# Altium project Base18.PrjPCB
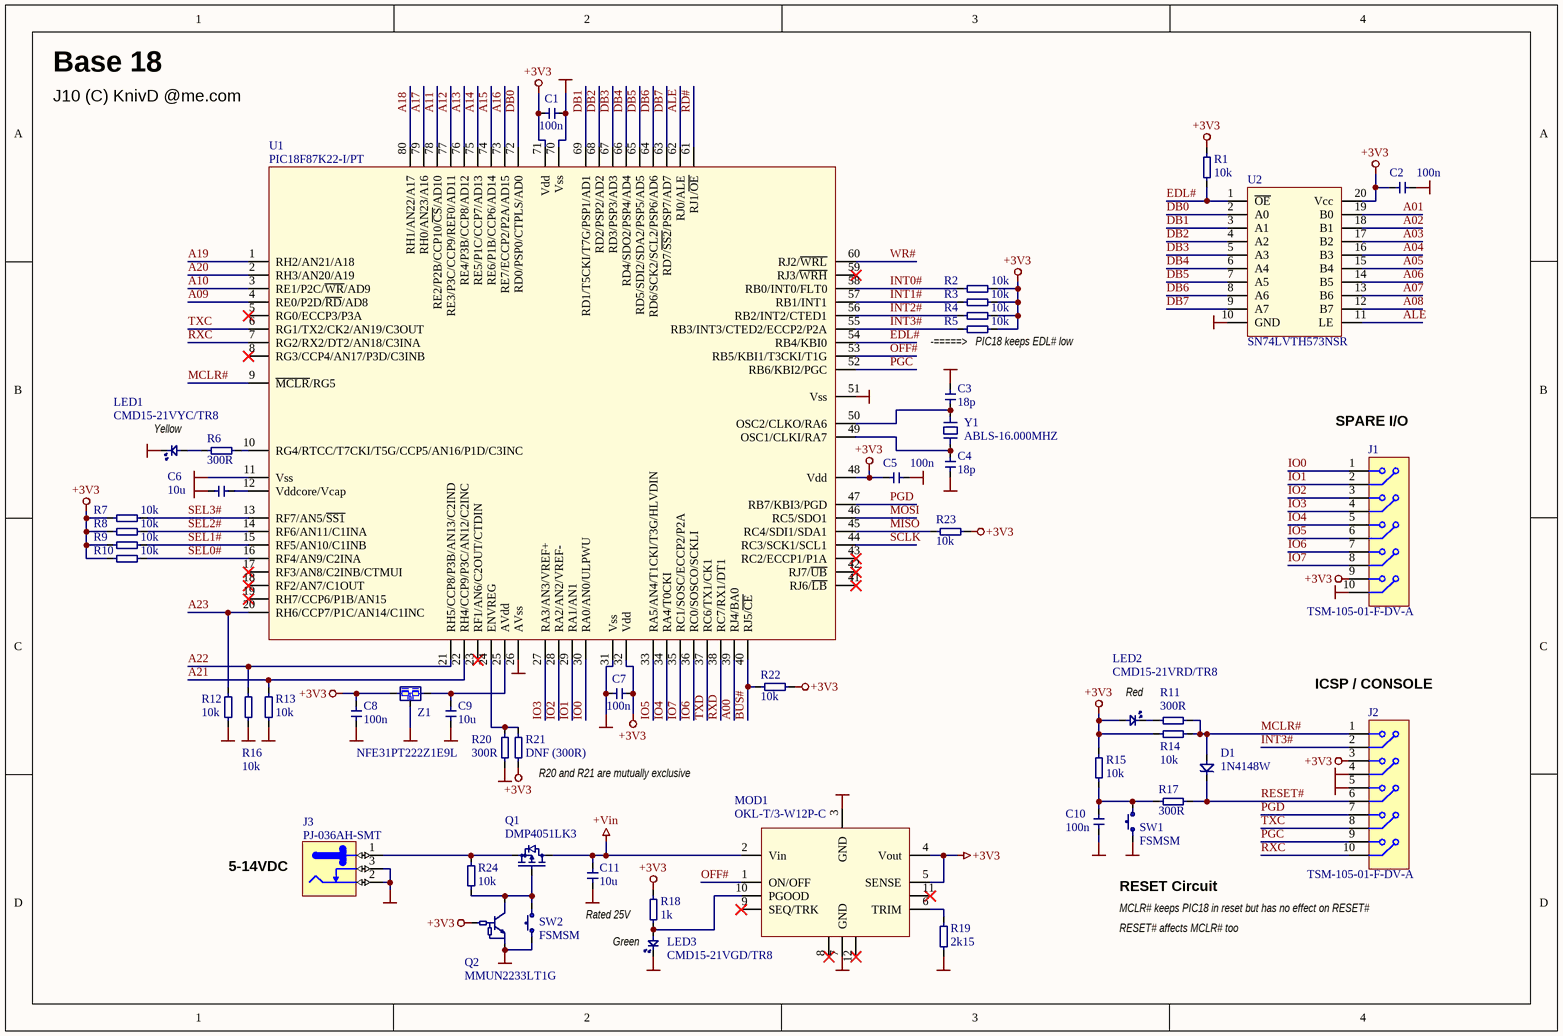
[diagram p0: Sheet1.SchDoc]
2 sheets, 59 parts. Net scope: global (net labels, ports and power ports of the same name join across sheets).
Board file: PCB1.PcbDoc
Sheets:
  Sheet1.SchDoc
  Sheet2.SchDoc

## Sheet Sheet1.SchDoc
size A4

### Parts
C1  100n  [CAPC3216X110N]
C2  100n  [CAPC3216X110N]
C3  18p  [CAPC3216X110N]
C4  18p  [CAPC3216X110N]
C5  100n  [CAPC3216X110N]
C6  10u  [CAPC3216X110N]
C7  100n  [CAPC3216X110N]
C8  100n  [CAPC3216X110N]
C9  10u  [CAPC3216X110N]
C10  100n  [CAPC3216X110N]
C11  Note: 10u  [CAPC3216X110N]  (hidden comment: 10u/25V)
D1  1N4148W  [SOD-123]
J1  TSM-105-01-F-DV-A  [2015-2X05XD]
J2  TSM-105-01-F-DV-A  [2015-2X05XD]
J3  PJ-036AH-SMT  [PJ-036AH-SMT]
LED1  CMD15-21VYC/TR8  [LED_OSRAM_LYN971]
LED2  CMD15-21VRD/TR8  [LED_OSRAM_LHN974]
LED3  CMD15-21VGD/TR8  [LED_OSRAM_LGN971]
MOD1  OKL-T/3-W12P-C  [OKL-T/3-W12]
Q1  DMP4051LK3  [TO228P991X239-3N-R546X521]
Q2  MMUN2233LT1G  [SOT23-3]
R1  10k  [RESC3216X75N]
R2  10k  [RESC3216X75N]
R3  10k  [RESC3216X75N]
R4  10k  [RESC3216X75N]
R5  10k  [RESC3216X75N]
R6  300R  [RESC3216X75N]
R7  10k  [RESC3216X75N]
R8  10k  [RESC3216X75N]
R9  10k  [RESC3216X75N]
R10  10k  [RESC3216X75N]
R11  300R  [RESC3216X75N]
R12  10k  [RESC3216X75N]
R13  10k  [RESC3216X75N]
R14  10k  [RESC3216X75N]
R15  10k  [RESC3216X75N]
R16  10k  [RESC3216X75N]
R17  300R  [RESC3216X75N]
R18  1k  [RESC3216X75N]
R19  2k15  [RESC3216X75N]
R20  300R  [RESC3216X75N]
R21  DNF (300R)  [RESC3216X75N]
R22  10k  [RESC3216X75N]
R23  10k  [RESC3216X75N]
R24  10k  [RESC3216X75N]
SW1  FSMSM  [PB_TYCO_FSMSM]
SW2  FSMSM  [PB_TYCO_FSMSM]
U1  PIC18F87K22-I/PT  [QFP50P1400X1400X120-80N]
U2  SN74LVTH573NSR  [SOIC127P780X200-20N]
Y1  ABLS-16.000MHZ  [XTAL1140X470X160N]
Z1  NFE31PT222Z1E9L  [NFE31xx]

### Nets
+3V3: C1.1 C2.1 C5.1 C7.1 C8.1 J1.9 J2.3 LED2.2 MOD1.4(Vout) MOD1.5(SENSE) Q2.1(B) R1.2 R2.1 R3.1 R4.1 R5.1 R7.1 R8.1 R9.1 R10.1 R14.2 R15.2 R18.1 R21.2 R22.1 R23.1 U1.32(Vdd) U1.48(Vdd) U1.71(Vdd) U2.20(Vcc) Z1.1
+Vin: C11.1 MOD1.2(Vin) Q1.3(D)
GND: C1.2 C2.2 C3.2 C4.1 C5.2 C6.2 C7.2 C8.2 C9.2 C10.1 C11.2 J1.10 J2.4 J2.5 J3.2 J3.3 LED1.1 LED3.1 MOD1.3(GND) MOD1.7(GND) Q2.2(E) R12.2 R13.2 R16.2 R19.1 R20.2 SW1.1 SW2.1 U1.11(Vss) U1.26(AVss) U1.31(Vss) U1.51(Vss) U1.70(Vss) U2.10(GND) Z1.2
A00: U1.39(RJ4/BA0)
A01: U2.19(B0)
A02: U2.18(B1)
A03: U2.17(B2)
A04: U2.16(B3)
A05: U2.15(B4)
A06: U2.14(B5)
A07: U2.13(B6)
A08: U2.12(B7)
A09: U1.4(RE0/P2D/~{RD}/AD8)
A10: U1.3(RE1/P2C/~{WR}/AD9)
A11: U1.78(RE2/P2B/CCP10/~{CS}/AD10)
A12: U1.77(RE3/P3C/CCP9/REF0/AD11)
A13: U1.76(RE4/P3B/CCP8/AD12)
A14: U1.75(RE5/P1C/CCP7/AD13)
A15: U1.74(RE6/P1B/CCP6/AD14)
A16: U1.73(RE7/ECCP2/P2A/AD15)
A17: U1.79(RH0/AN23/A16)
A18: U1.80(RH1/AN22/A17)
A19: U1.1(RH2/AN21/A18)
A20: U1.2(RH3/AN20/A19)
A21: R13.1 U1.22(RH4/CCP9/P3C/AN12/C2INC)
A22: R16.1 U1.21(RH5/CCP8/P3B/AN13/C2IND)
A23: R12.1 U1.20(RH6/CCP7/P1C/AN14/C1INC)
ALE: U1.62(RJ0/ALE) U2.11(LE)
BUS#: R22.2 U1.40(RJ5/~{CE})
DB0: U1.72(RD0/PSP0/CTPLS/AD0) U2.2(A0)
DB1: U1.69(RD1/T5CKI/T7G/PSP1/AD1) U2.3(A1)
DB2: U1.68(RD2/PSP2/AD2) U2.4(A2)
DB3: U1.67(RD3/PSP3/AD3) U2.5(A3)
DB4: U1.66(RD4/SDO2/PSP4/AD4) U2.6(A4)
DB5: U1.65(RD5/SDI2/SDA2/PSP5/AD5) U2.7(A5)
DB6: U1.64(RD6/SCK2/SCL2/PSP6/AD6) U2.8(A6)
DB7: U1.63(RD7/~{SS2}/PSP7/AD7) U2.9(A7)
EDL#: R1.1 U1.54(RB4/KBI0) U2.1(~{OE})
INT0#: R2.2 U1.58(RB0/INT0/FLT0)
INT1#: R3.2 U1.57(RB1/INT1)
INT2#: R4.2 U1.56(RB2/INT2/CTED1)
INT3#: J2.2 R5.2 U1.55(RB3/INT3/CTED2/ECCP2/P2A)
IO0: J1.1 U1.30(RA0/AN0/ULPWU)
IO1: J1.2 U1.29(RA1/AN1)
IO2: J1.3 U1.28(RA2/AN2/VREF-)
IO3: J1.4 U1.27(RA3/AN3/VREF+)
IO4: J1.5 U1.34(RA4/T0CKI)
IO5: J1.6 U1.33(RA5/AN4/T1CKI/T3G/HLVDIN)
IO6: J1.7 U1.36(RC0/SOSCO/SCKLI)
IO7: J1.8 U1.35(RC1/SOSC/ECCP2/P2A)
MCLR#: D1.2 J2.1 R11.1 R14.1 U1.9(~{MCLR}/RG5)
MISO: R23.2 U1.45(RC4/SDI1/SDA1)
MOSI: U1.46(RC5/SDO1)
OFF#: MOD1.1(ON/OFF) U1.53(RB5/KBI1/T3CKI/T1G)
PGC: J2.9 U1.52(RB6/KBI2/PGC)
PGD: J2.7 U1.47(RB7/KBI3/PGD)
RD#: U1.61(RJ1/~{OE})
RESET#: D1.1 J2.6 R17.2
RXC: J2.10 U1.7(RG2/RX2/DT2/AN18/C3INA)
RXD: U1.38(RC7/RX1/DT1)
SCLK: U1.44(RC3/SCK1/SCL1)
SEL0#: R10.2 U1.16(RF4/AN9/C2INA)
SEL1#: R9.2 U1.15(RF5/AN10/C1INB)
SEL2#: R8.2 U1.14(RF6/AN11/C1INA)
SEL3#: R7.2 U1.13(RF7/AN5/~{SS1})
TXC: J2.8 U1.6(RG1/TX2/CK2/AN19/C3OUT)
TXD: U1.37(RC6/TX1/CK1)
WR#: U1.60(RJ2/~{WRL})
NetC3_1: C3.1 U1.50(OSC2/CLKO/RA6) Y1.2
NetC4_2: C4.2 U1.49(OSC1/CLKI/RA7) Y1.1
NetC6_1: C6.1 U1.12(Vddcore/Vcap)
NetC9_1: C9.1 U1.25(AVdd) Z1.3
NetC10_2: C10.2 R15.1 R17.1 SW1.2
NetJ3_1: J3.1 Q1.2(S) R24.2
NetLED1_2: LED1.2 R6.1
NetLED2_1: LED2.1 R11.2
NetLED3_2: LED3.2 MOD1.10(PGOOD) R18.2
NetMOD1_6: MOD1.6(TRIM) R19.2
NetQ1_1: Q1.1(G) Q2.3(C) R24.1 SW2.2
NetR6_2: R6.2 U1.10(RG4/RTCC/T7CKI/T5G/CCP5/AN16/P1D/C3INC)
NetR20_1: R20.1 R21.1 U1.24(ENVREG)

Not connected (* = marked no-connect by the designer): MOD1 8* 9(SEQ/TRK)* 11* 12*; U1 5(RG0/ECCP3/P3A)* 8(RG3/CCP4/AN17/P3D/C3INB)* 17(RF3/AN8/C2INB/CTMUI)* 18(RF2/AN7/C1OUT)* 19(RH7/CCP6/P1B/AN15)* 23(RF1/AN6/C2OUT/CTDIN)* 41(RJ6/~{LB})* 42(RJ7/~{UB})* 43(RC2/ECCP1/P1A)* 59(RJ3/~{WRH})*

### Notes on the sheet
- Base 18
- J10 (C) KnivD @me.com
- (near R5) -=====>   PIC18 keeps EDL# low
- Yellow
- (near J1) SPARE I/O
- Red
- (near J2) ICSP / CONSOLE
- R20 and R21 are mutually exclusive
- 5-14VDC
- Rated 25V
- RESET Circuit
- MCLR# keeps PIC18 in reset but has no effect on RESET#
- Green
- RESET# affects MCLR# too

### Library data of the parts
C1-C11 = Capacitor
D1 = Diode Schottky: Schottky diode
J1 J2 = Connector 2x5: Dual row, 10-way connector
J3 = LUMBERG_161314: 2.1/5.5mm barrel power jack, SMT; Component Kind: Standard; Component Type: Standard; ComponentHeight: 11mm; Author: CERN DEM JLC
LED1-LED3 = LED: Light Emitting Diode
MOD1 = OKL-T/3-W12: Programmable Output 3-Amp iLGA SMT PoLs; Manufacturer: Murata
Q1 = P-FET: P-channel FET transistor
Q2 = NPN BIASED: NPN biased bipolar transistor
R1-R24 = Resistor
SW1 SW2 = Switch MNO SPST: Switch, Momentary, Normal Open
U1 = PIC18F87K22: High-Performance, 1-Mbit Enhanced Flash MCUs  with 12-Bit A/D and XLP Technology; Manufacturer: Microchip; Packages: I/PT (TQFP80-12x12mm); I/MR (QFN80-9x9mm)
U2 = 74xxx373: A Octal Transparent D-Type Latches With 3-State Outputs
Y1 = Crystal: Crystal Resonator
Z1 = Filter: Hybrid filter

## Sheet Sheet2.SchDoc
size A4
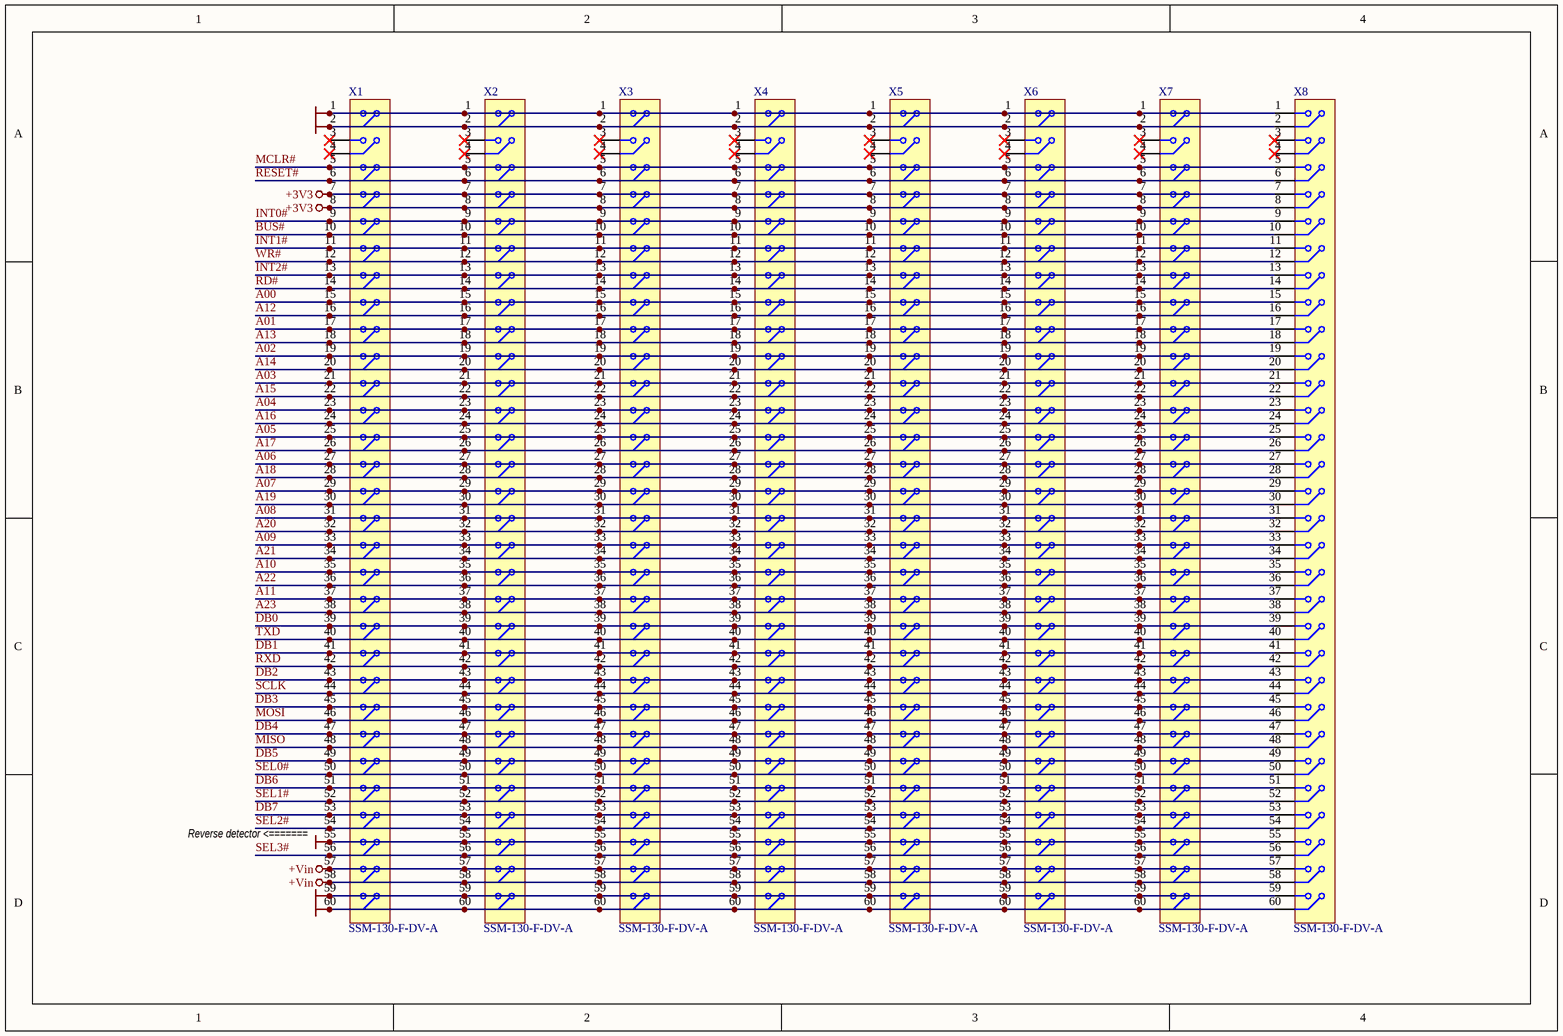
[diagram p1: Sheet2.SchDoc]

### Parts
X1  SSM-130-F-DV-A  [2015-2X30XD]
X2  SSM-130-F-DV-A  [2015-2X30XD]
X3  SSM-130-F-DV-A  [2015-2X30XD]
X4  SSM-130-F-DV-A  [2015-2X30XD]
X5  SSM-130-F-DV-A  [2015-2X30XD]
X6  SSM-130-F-DV-A  [2015-2X30XD]
X7  SSM-130-F-DV-A  [2015-2X30XD]
X8  SSM-130-F-DV-A  [2015-2X30XD]

### Nets
+3V3: X1.7 X1.8 X2.7 X2.8 X3.7 X3.8 X4.7 X4.8 X5.7 X5.8 X6.7 X6.8 X7.7 X7.8 X8.7 X8.8
+Vin: X1.57 X1.58 X2.57 X2.58 X3.57 X3.58 X4.57 X4.58 X5.57 X5.58 X6.57 X6.58 X7.57 X7.58 X8.57 X8.58
GND: X1.1 X1.2 X1.55 X1.59 X1.60 X2.1 X2.2 X2.55 X2.59 X2.60 X3.1 X3.2 X3.55 X3.59 X3.60 X4.1 X4.2 X4.55 X4.59 X4.60 X5.1 X5.2 X5.55 X5.59 X5.60 X6.1 X6.2 X6.55 X6.59 X6.60 X7.1 X7.2 X7.55 X7.59 X7.60 X8.1 X8.2 X8.55 X8.59 X8.60
A00: X1.15 X2.15 X3.15 X4.15 X5.15 X6.15 X7.15 X8.15
A01: X1.17 X2.17 X3.17 X4.17 X5.17 X6.17 X7.17 X8.17
A02: X1.19 X2.19 X3.19 X4.19 X5.19 X6.19 X7.19 X8.19
A03: X1.21 X2.21 X3.21 X4.21 X5.21 X6.21 X7.21 X8.21
A04: X1.23 X2.23 X3.23 X4.23 X5.23 X6.23 X7.23 X8.23
A05: X1.25 X2.25 X3.25 X4.25 X5.25 X6.25 X7.25 X8.25
A06: X1.27 X2.27 X3.27 X4.27 X5.27 X6.27 X7.27 X8.27
A07: X1.29 X2.29 X3.29 X4.29 X5.29 X6.29 X7.29 X8.29
A08: X1.31 X2.31 X3.31 X4.31 X5.31 X6.31 X7.31 X8.31
A09: X1.33 X2.33 X3.33 X4.33 X5.33 X6.33 X7.33 X8.33
A10: X1.35 X2.35 X3.35 X4.35 X5.35 X6.35 X7.35 X8.35
A11: X1.37 X2.37 X3.37 X4.37 X5.37 X6.37 X7.37 X8.37
A12: X1.16 X2.16 X3.16 X4.16 X5.16 X6.16 X7.16 X8.16
A13: X1.18 X2.18 X3.18 X4.18 X5.18 X6.18 X7.18 X8.18
A14: X1.20 X2.20 X3.20 X4.20 X5.20 X6.20 X7.20 X8.20
A15: X1.22 X2.22 X3.22 X4.22 X5.22 X6.22 X7.22 X8.22
A16: X1.24 X2.24 X3.24 X4.24 X5.24 X6.24 X7.24 X8.24
A17: X1.26 X2.26 X3.26 X4.26 X5.26 X6.26 X7.26 X8.26
A18: X1.28 X2.28 X3.28 X4.28 X5.28 X6.28 X7.28 X8.28
A19: X1.30 X2.30 X3.30 X4.30 X5.30 X6.30 X7.30 X8.30
A20: X1.32 X2.32 X3.32 X4.32 X5.32 X6.32 X7.32 X8.32
A21: X1.34 X2.34 X3.34 X4.34 X5.34 X6.34 X7.34 X8.34
A22: X1.36 X2.36 X3.36 X4.36 X5.36 X6.36 X7.36 X8.36
A23: X1.38 X2.38 X3.38 X4.38 X5.38 X6.38 X7.38 X8.38
BUS#: X1.10 X2.10 X3.10 X4.10 X5.10 X6.10 X7.10 X8.10
DB0: X1.39 X2.39 X3.39 X4.39 X5.39 X6.39 X7.39 X8.39
DB1: X1.41 X2.41 X3.41 X4.41 X5.41 X6.41 X7.41 X8.41
DB2: X1.43 X2.43 X3.43 X4.43 X5.43 X6.43 X7.43 X8.43
DB3: X1.45 X2.45 X3.45 X4.45 X5.45 X6.45 X7.45 X8.45
DB4: X1.47 X2.47 X3.47 X4.47 X5.47 X6.47 X7.47 X8.47
DB5: X1.49 X2.49 X3.49 X4.49 X5.49 X6.49 X7.49 X8.49
DB6: X1.51 X2.51 X3.51 X4.51 X5.51 X6.51 X7.51 X8.51
DB7: X1.53 X2.53 X3.53 X4.53 X5.53 X6.53 X7.53 X8.53
INT0#: X1.9 X2.9 X3.9 X4.9 X5.9 X6.9 X7.9 X8.9
INT1#: X1.11 X2.11 X3.11 X4.11 X5.11 X6.11 X7.11 X8.11
INT2#: X1.13 X2.13 X3.13 X4.13 X5.13 X6.13 X7.13 X8.13
MCLR#: X1.5 X2.5 X3.5 X4.5 X5.5 X6.5 X7.5 X8.5
MISO: X1.48 X2.48 X3.48 X4.48 X5.48 X6.48 X7.48 X8.48
MOSI: X1.46 X2.46 X3.46 X4.46 X5.46 X6.46 X7.46 X8.46
RD#: X1.14 X2.14 X3.14 X4.14 X5.14 X6.14 X7.14 X8.14
RESET#: X1.6 X2.6 X3.6 X4.6 X5.6 X6.6 X7.6 X8.6
RXD: X1.42 X2.42 X3.42 X4.42 X5.42 X6.42 X7.42 X8.42
SCLK: X1.44 X2.44 X3.44 X4.44 X5.44 X6.44 X7.44 X8.44
SEL0#: X1.50 X2.50 X3.50 X4.50 X5.50 X6.50 X7.50 X8.50
SEL1#: X1.52 X2.52 X3.52 X4.52 X5.52 X6.52 X7.52 X8.52
SEL2#: X1.54 X2.54 X3.54 X4.54 X5.54 X6.54 X7.54 X8.54
SEL3#: X1.56 X2.56 X3.56 X4.56 X5.56 X6.56 X7.56 X8.56
TXD: X1.40 X2.40 X3.40 X4.40 X5.40 X6.40 X7.40 X8.40
WR#: X1.12 X2.12 X3.12 X4.12 X5.12 X6.12 X7.12 X8.12

Not connected (* = marked no-connect by the designer): X1 3* 4*; X2 3* 4*; X3 3* 4*; X4 3* 4*; X5 3* 4*; X6 3* 4*; X7 3* 4*; X8 3* 4*

### Notes on the sheet
- (near X1) Reverse detector <=======

### Library data of the parts
X1-X8 = Connector 2x30: Dual row, 60-way connector

## Nets that join several sheets
+3V3: Sheet1 (31 pins), Sheet2 (16 pins)
+Vin: Sheet1 (C11.1 MOD1.2 Q1.3), Sheet2 (16 pins)
GND: Sheet1 (35 pins), Sheet2 (40 pins)
A00: Sheet1 (U1.39), Sheet2 (8 pins)
A01: Sheet1 (U2.19), Sheet2 (8 pins)
A02: Sheet1 (U2.18), Sheet2 (8 pins)
A03: Sheet1 (U2.17), Sheet2 (8 pins)
A04: Sheet1 (U2.16), Sheet2 (8 pins)
A05: Sheet1 (U2.15), Sheet2 (8 pins)
A06: Sheet1 (U2.14), Sheet2 (8 pins)
A07: Sheet1 (U2.13), Sheet2 (8 pins)
A08: Sheet1 (U2.12), Sheet2 (8 pins)
A09: Sheet1 (U1.4), Sheet2 (8 pins)
A10: Sheet1 (U1.3), Sheet2 (8 pins)
A11: Sheet1 (U1.78), Sheet2 (8 pins)
A12: Sheet1 (U1.77), Sheet2 (8 pins)
A13: Sheet1 (U1.76), Sheet2 (8 pins)
A14: Sheet1 (U1.75), Sheet2 (8 pins)
A15: Sheet1 (U1.74), Sheet2 (8 pins)
A16: Sheet1 (U1.73), Sheet2 (8 pins)
A17: Sheet1 (U1.79), Sheet2 (8 pins)
A18: Sheet1 (U1.80), Sheet2 (8 pins)
A19: Sheet1 (U1.1), Sheet2 (8 pins)
A20: Sheet1 (U1.2), Sheet2 (8 pins)
A21: Sheet1 (R13.1 U1.22), Sheet2 (8 pins)
A22: Sheet1 (R16.1 U1.21), Sheet2 (8 pins)
A23: Sheet1 (R12.1 U1.20), Sheet2 (8 pins)
BUS#: Sheet1 (R22.2 U1.40), Sheet2 (8 pins)
DB0: Sheet1 (U1.72 U2.2), Sheet2 (8 pins)
DB1: Sheet1 (U1.69 U2.3), Sheet2 (8 pins)
DB2: Sheet1 (U1.68 U2.4), Sheet2 (8 pins)
DB3: Sheet1 (U1.67 U2.5), Sheet2 (8 pins)
DB4: Sheet1 (U1.66 U2.6), Sheet2 (8 pins)
DB5: Sheet1 (U1.65 U2.7), Sheet2 (8 pins)
DB6: Sheet1 (U1.64 U2.8), Sheet2 (8 pins)
DB7: Sheet1 (U1.63 U2.9), Sheet2 (8 pins)
INT0#: Sheet1 (R2.2 U1.58), Sheet2 (8 pins)
INT1#: Sheet1 (R3.2 U1.57), Sheet2 (8 pins)
INT2#: Sheet1 (R4.2 U1.56), Sheet2 (8 pins)
MCLR#: Sheet1 (5 pins), Sheet2 (8 pins)
MISO: Sheet1 (R23.2 U1.45), Sheet2 (8 pins)
MOSI: Sheet1 (U1.46), Sheet2 (8 pins)
RD#: Sheet1 (U1.61), Sheet2 (8 pins)
RESET#: Sheet1 (D1.1 J2.6 R17.2), Sheet2 (8 pins)
RXD: Sheet1 (U1.38), Sheet2 (8 pins)
SCLK: Sheet1 (U1.44), Sheet2 (8 pins)
SEL0#: Sheet1 (R10.2 U1.16), Sheet2 (8 pins)
SEL1#: Sheet1 (R9.2 U1.15), Sheet2 (8 pins)
SEL2#: Sheet1 (R8.2 U1.14), Sheet2 (8 pins)
SEL3#: Sheet1 (R7.2 U1.13), Sheet2 (8 pins)
TXD: Sheet1 (U1.37), Sheet2 (8 pins)
WR#: Sheet1 (U1.60), Sheet2 (8 pins)